# Altium schematic sheet ESC_2S-5S.SchDoc: H-Bridge and Gate driver
size A4; Organization: Use Organization_Name in ProjParam; Address1: Eliot Ferragni; Address2: STI-MOBOTS; Address3: EPFL; Address4: CH-1015 LAUSANNE; DocumentNumber: 6; Revision: A; SheetNumber: 6; SheetTotal: 7; ApprovedBy: Init ApprovedBy in DocParam; CheckedBy: Init CheckedBy in DocParam; Author: Init Author in DocParam; CompanyName: Init CompanyName in DocParam; DrawnBy: Init DrawBy in DocParam; Engineer: Init Engineer in DocParam; DocumentName: Init DocumentName in DocParam; ProjectName: Init ProjectName in DocParam
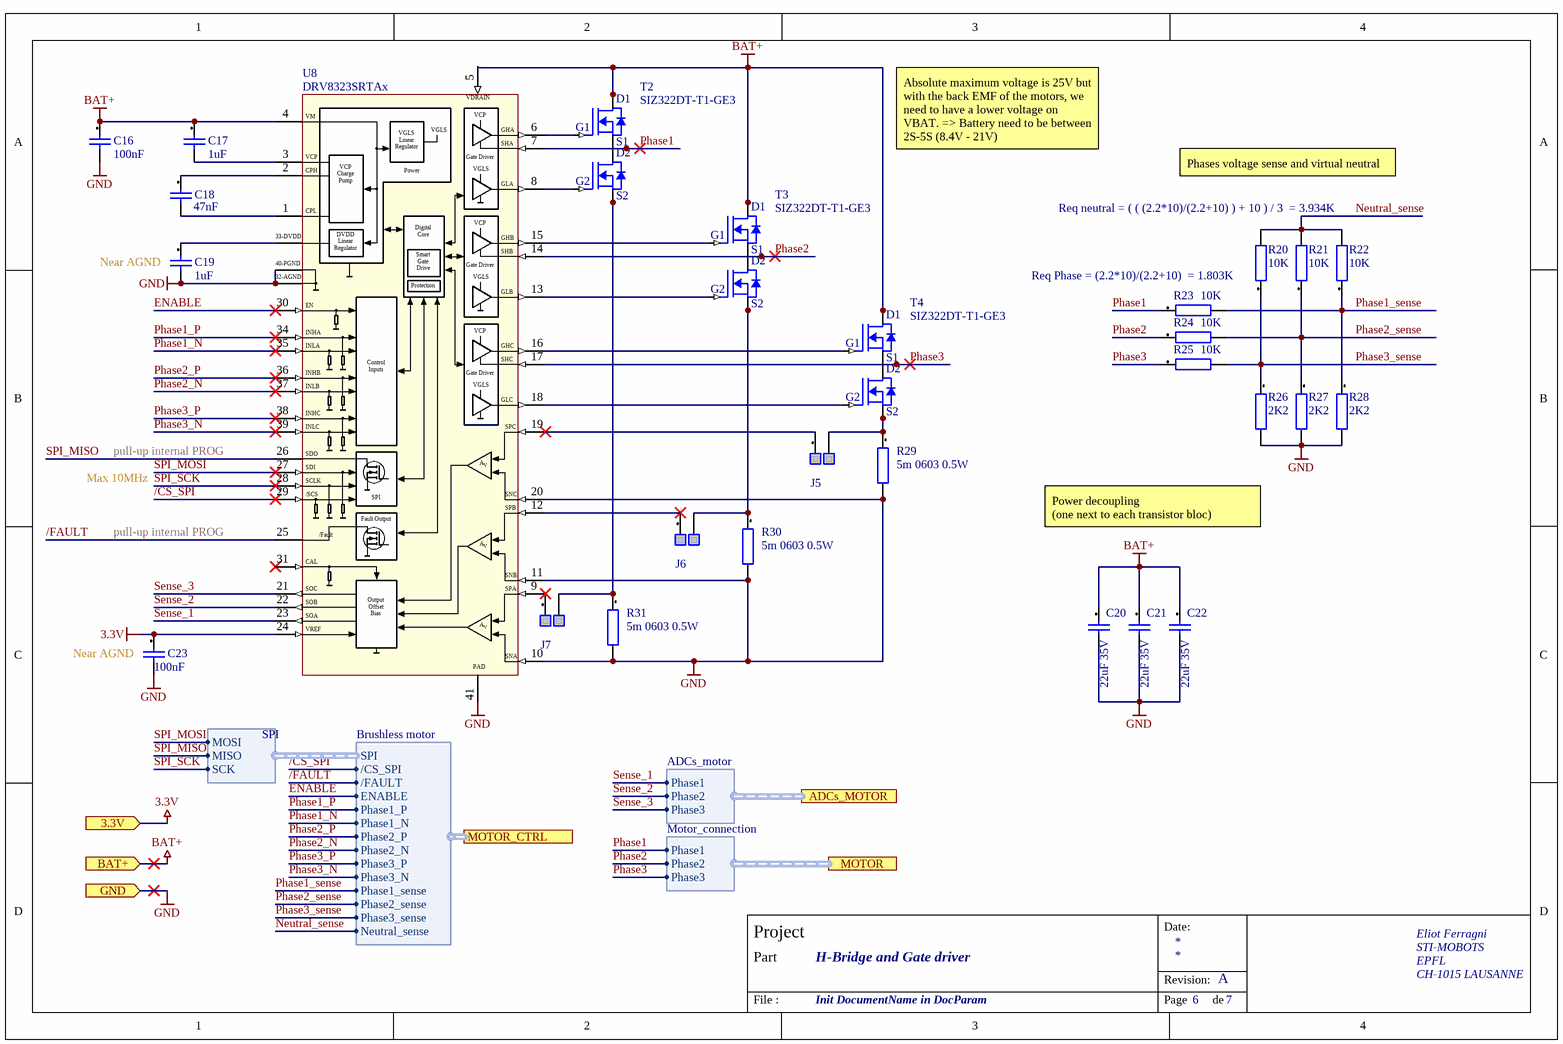
[diagram p0: ESC_2S-5S.SchDoc]

## Parts
C16  100nF  [CAPC1608X08L]
C17  1uF  [CAPC1608X08L]
C18  47nF  [CAPC1608X08L]
C19  1uF  [CAPC1608X08L]
C20  22uF 35V  [CAPC3216X17L]
C21  22uF 35V  [CAPC3216X17L]
C22  22uF 35V  [CAPC3216X17L]
C23  100nF  [CAPC1608X08L]
J5  CC_SolderJP2_Medium  [CC_SolderJP_M]  (value not drawn)  (no BOM)
J6  CC_SolderJP2_Medium  [CC_SolderJP_M]  (value not drawn)  (no BOM)
J7  CC_SolderJP2_Medium  [CC_SolderJP_M]  (value not drawn)  (no BOM)
R20  10K  [RESC1608X06N]
R21  10K  [RESC1608X06N]
R22  10K  [RESC1608X06N]
R23  10K  [RESC1608X06N]
R24  10K  [RESC1608X06N]
R25  10K  [RESC1608X06N]
R26  2K2  [RESC1608X06N]
R27  2K2  [RESC1608X06N]
R28  2K2  [RESC1608X06N]
R29  5m 0603 0.5W  [RESC1608X06L]
R30  5m 0603 0.5W  [RESC1608X06L]
R31  5m 0603 0.5W  [RESC1608X06L]
T2  SIZ322DT-T1-GE3  [PowerPair 3x3]
T3  SIZ322DT-T1-GE3  [PowerPair 3x3]
T4  SIZ322DT-T1-GE3  [PowerPair 3x3]
U8  DRV8323SRTAx  [RTA0040B_NV]

## Ports
3.3V (in), ADCs_MOTOR (harness ADCs_motor), BAT+ (in), GND (in), MOTOR (harness Motor_connection), MOTOR_CTRL (harness Brushless motor)

## Harnesses
Motor_connection: Phase1, Phase2, Phase3
SPI: MISO, MOSI, SCK
ADCs_motor: Phase1, Phase2, Phase3
Brushless motor: Phase1_P, Phase1_N, Phase2_P, Phase2_N, Phase3_P, Phase3_N, Phase1_sense, Phase2_sense, Phase3_sense, Neutral_sense, /CS_SPI, SPI, ENABLE, /FAULT

## Nets
3.3V: C23.1 U8.24(VREF) ; port 3.3V
BAT+: C16.1 C17.1 C20.1 C21.1 C22.1 T2.2(D1) T2.3(D1) T2.4(D1) T2.10(D1) T3.2(D1) T3.3(D1) T3.4(D1) T3.10(D1) T4.2(D1) T4.3(D1) T4.4(D1) T4.10(D1) U8.4(VM) U8.5(VDRAIN) ; port BAT+
GND: C16.2 C19.2 C20.2 C21.2 C22.2 C23.2 R26.2 R27.2 R28.2 R29.2 R30.2 R31.2 U8.10(SNA) U8.11(SNB) U8.20(SNC) U8.32(AGND) U8.40(PGND) U8.41(PAD) ; port GND
/CS_SPI: U8.29(GAIN_SCS_N) ; port MOTOR_CTRL./CS_SPI
/FAULT: U8.25(FAULT_N) ; port MOTOR_CTRL./FAULT
ENABLE: U8.30(ENABLE) ; port MOTOR_CTRL.ENABLE
Neutral_sense: R20.2 R21.2 R22.2 ; port MOTOR_CTRL.Neutral_sense
Phase1: R23.1 T2.9(S1/D2) U8.7(SHA) ; port MOTOR.Phase1
Phase1_N: U8.35(INLA) ; port MOTOR_CTRL.Phase1_N
Phase1_P: U8.34(INHA) ; port MOTOR_CTRL.Phase1_P
Phase1_sense: R22.1 R23.2 R28.1 ; port MOTOR_CTRL.Phase1_sense
Phase2: R24.1 T3.9(S1/D2) U8.14(SHB) ; port MOTOR.Phase2
Phase2_N: U8.37(INLB) ; port MOTOR_CTRL.Phase2_N
Phase2_P: U8.36(INHB) ; port MOTOR_CTRL.Phase2_P
Phase2_sense: R21.1 R24.2 R27.1 ; port MOTOR_CTRL.Phase2_sense
Phase3: R25.1 T4.9(S1/D2) U8.17(SHC) ; port MOTOR.Phase3
Phase3_N: U8.39(INLC) ; port MOTOR_CTRL.Phase3_N
Phase3_P: U8.38(INHC) ; port MOTOR_CTRL.Phase3_P
Phase3_sense: R20.1 R25.2 R26.1 ; port MOTOR_CTRL.Phase3_sense
Sense_1: U8.23(SOA) ; port ADCs_MOTOR.Phase1
Sense_2: U8.22(SOB) ; port ADCs_MOTOR.Phase2
Sense_3: U8.21(SOC) ; port ADCs_MOTOR.Phase3
SPI_MISO: U8.26(MODE_SDO) ; harness SPI.MISO
SPI_MOSI: U8.27(IDRIVE_SDI) ; harness SPI.MOSI
SPI_SCK: U8.28(VDS_SCLK) ; harness SPI.SCK
NetC17_2: C17.2 U8.3(VCP)
NetC18_1: C18.1 U8.2(CPH)
NetC18_2: C18.2 U8.1(CPL)
NetC19_1: C19.1 U8.33(DVDD)
NetJ5_1: J5.1 U8.19(SPC)
NetJ5_2: J5.2 R29.1 T4.5(S2) T4.6(S2) T4.7(S2)
NetJ6_1: J6.1 U8.12(SPB)
NetJ6_2: J6.2 R30.1 T3.5(S2) T3.6(S2) T3.7(S2)
NetJ7_1: J7.1 U8.9(SPA)
NetJ7_2: J7.2 R31.1 T2.5(S2) T2.6(S2) T2.7(S2)
NetT2_1: T2.1(G1) U8.6(GHA)
NetT2_8: T2.8(G2) U8.8(GLA)
NetT3_1: T3.1(G1) U8.15(GHB)
NetT3_8: T3.8(G2) U8.13(GLB)
NetT4_1: T4.1(G1) U8.16(GHC)
NetT4_8: T4.8(G2) U8.18(GLC)

Not connected (* = marked no-connect by the designer): U8 31(CAL)*

## Notes on the sheet
- Absolute maximum voltage is 25V but with the back EMF of the motors, we need to have a lower voltage on VBAT. => Battery need to be between 2S-5S (8.4V - 21V)
- Phases voltage sense and virtual neutral voltage sense
- Req neutral = ( ( (2.2*10)/(2.2+10) ) + 10 ) / 3  = 3.934K
- (near C19) Near AGND
- (near R20) Req Phase = (2.2*10)/(2.2+10)  = 1.803K
- pull-up internal PROG
- Max 10MHz
- Power decoupling
  (one next to each transistor bloc)
- (near C23) Near AGND
- Date:
- Project
- Part
- Revision:
- File :
- Page
- de
- (in symbol DRV8323SRTAx) VGLS; / VGLS / Linear / Regulator; Gate Driver; Power; / VCP / Charge / Pump; 33-DVDD; DVDD / Linear / Regulator; 40-PGND; Smart / Gate / Drive; 32-AGND; Protection; / Digital / Core; EN; / Control / Inputs; SDO; A; SDI; V; SCLK; /SCS; / SPI; /Fault; Fault Output; / Output / Offset / Bias
- (in symbol SIZ322DT-T1-GE3) S1; D2

## Library data of the parts
C16-C19 C23 = TBD Capacitor[[/\]]0603[[/\]]1: Capacitor TBD 0603; Preference: 1; Currentie: CHF; Size: 0603; Footprint Acort: 0603_G; ROHS: True; DateLastUpdate: 2012-11-19 / 14:36:40
C20-C22 = TBD Capacitor[[/\]]1206[[/\]]1: Capacitor TBD 1206; Preference: 1; Currentie: CHF; Size: 1206; Footprint Acort: 1206; ROHS: True; DateLastUpdate: 2012-11-19 / 14:37:26
J5-J7 = CC_SolderJP2_Medium: Medium Solder Jumper 2 leads; Preference: 1; Footprint Acort: ToDefine; DateLastUpdate: 2007-11-06 / 20:24:14
R20-R28 = TBD[[/\]]0603[[/\]]1: Resistor ToDo 0603; Preference: 1; Currentie: CHF; Size: 0603; Footprint Acort: 0603; ROHS: True; DateLastUpdate: 2012-11-19 / 14:13:33
R29-R31 = TBD[[/\]]0603[[/\]]1: MFC0603-R005FT5; Preference: 1; Currentie: CHF; Size: 0603; Footprint Acort: 0603; ROHS: True; DateLastUpdate: 2012-11-19 / 14:13:33
T2-T4 = SIZ322DT-T1-GE3: Manufacturer: Vishay Siliconix; Supplier 1: Digi-Key; Stock 1: 0; Pricing 1: 3000=0.37036 (USD); Supplier Part Number 1: SIZ322DT-T1-GE3TR-ND; Manufacturer Part Number: SIZ322DT-T1-GE3
U8 = DRV8323SRTAx: 6 to 60-V Three-Phase Smart Gate Driver, 3 current sense amplifiers, SPI interface, 6 x 6 × 0.75 mm QFN; Manufacturer: Texas Instruments; PartNumber: DRV8323HRTAR; RefDes: RefDes; Type: DEV; Value: Value